# EAGLE board headstage-neuropix (EAGLE 8.3.2)
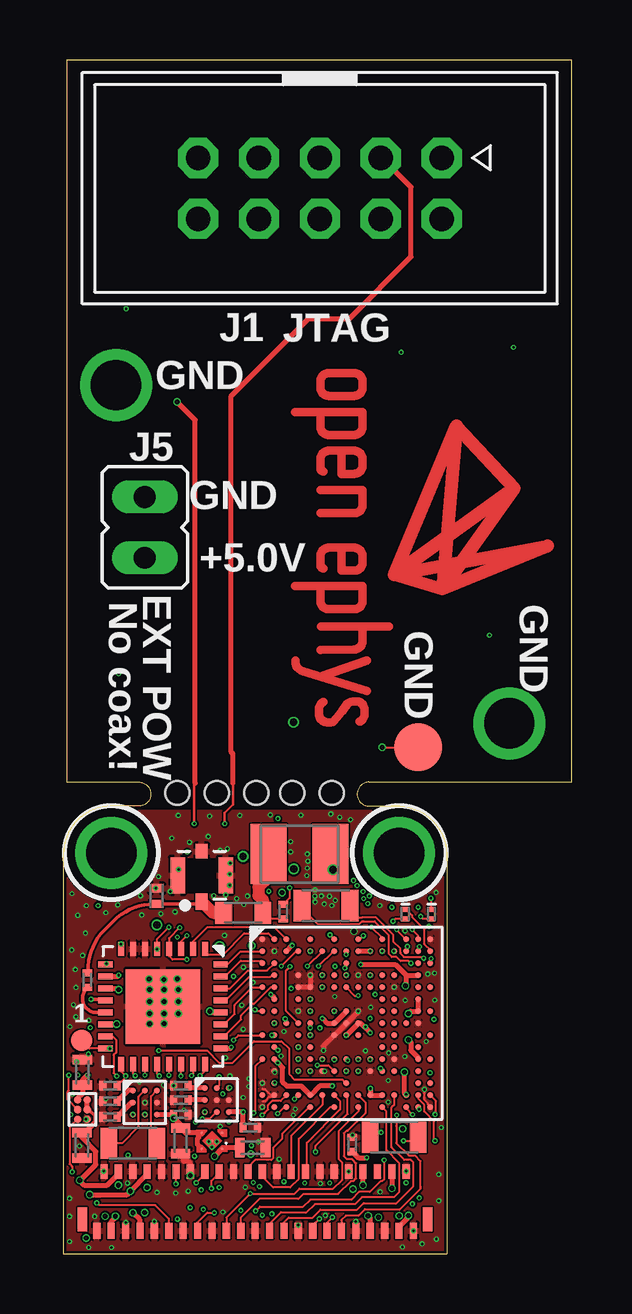
[diagram p5: board, top side]
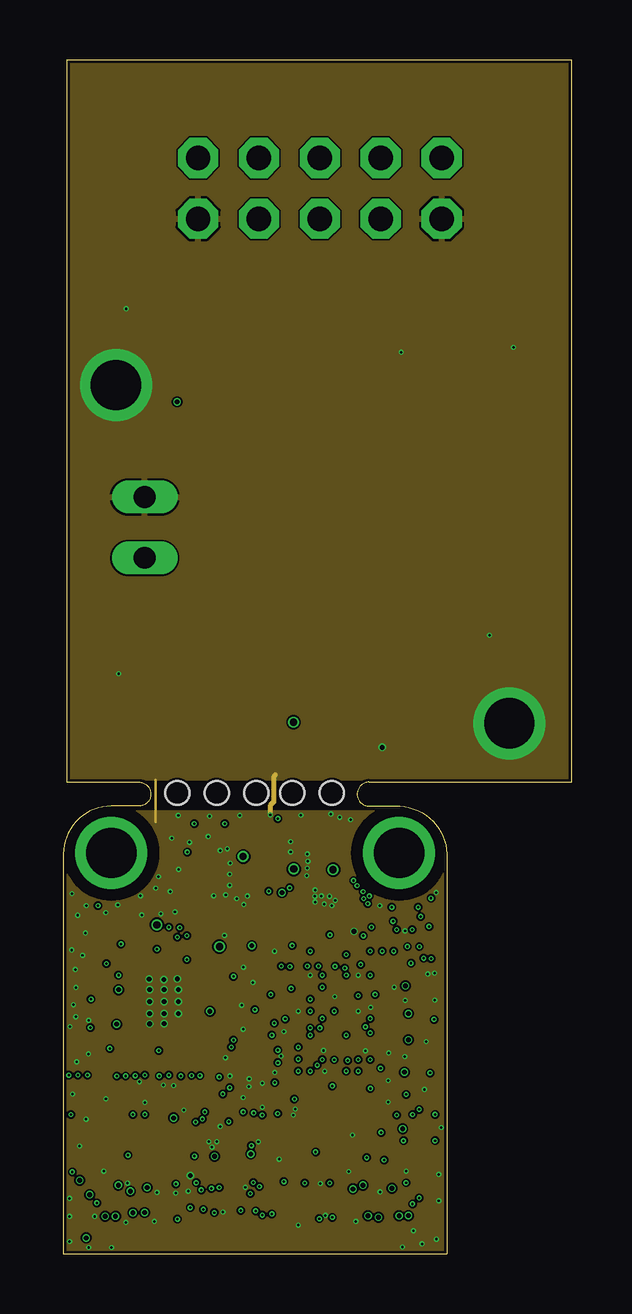
[diagram p6: board, inner layer GND1]
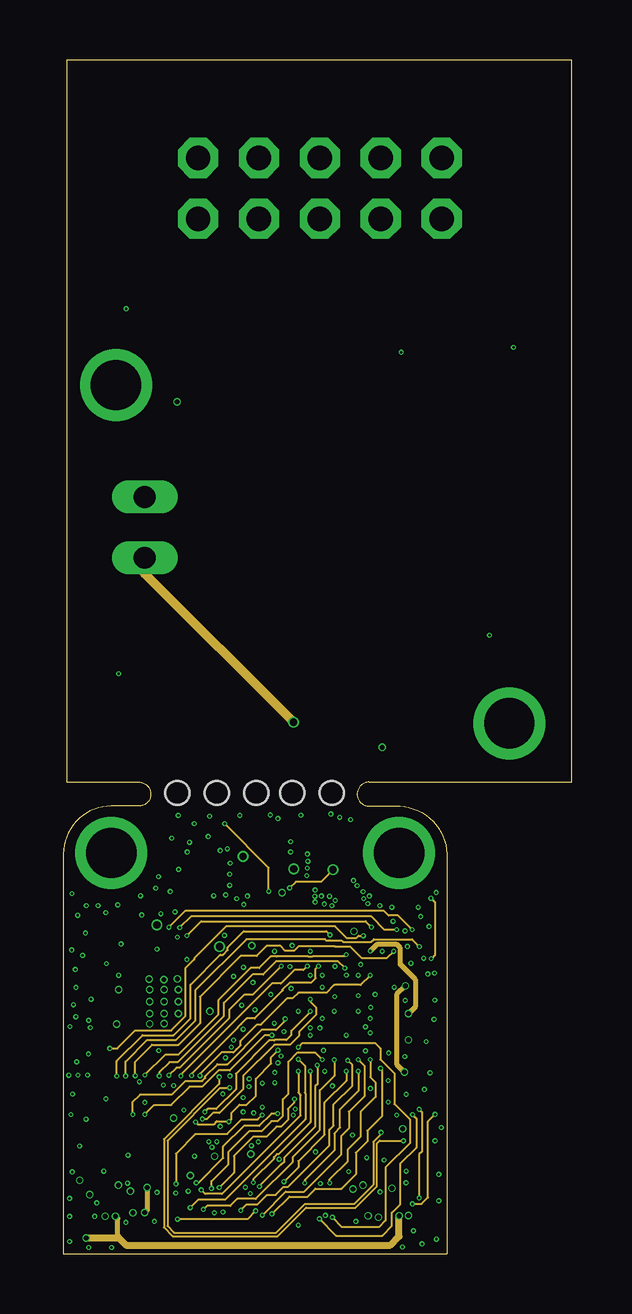
[diagram p7: board, inner layer Highspeed2]
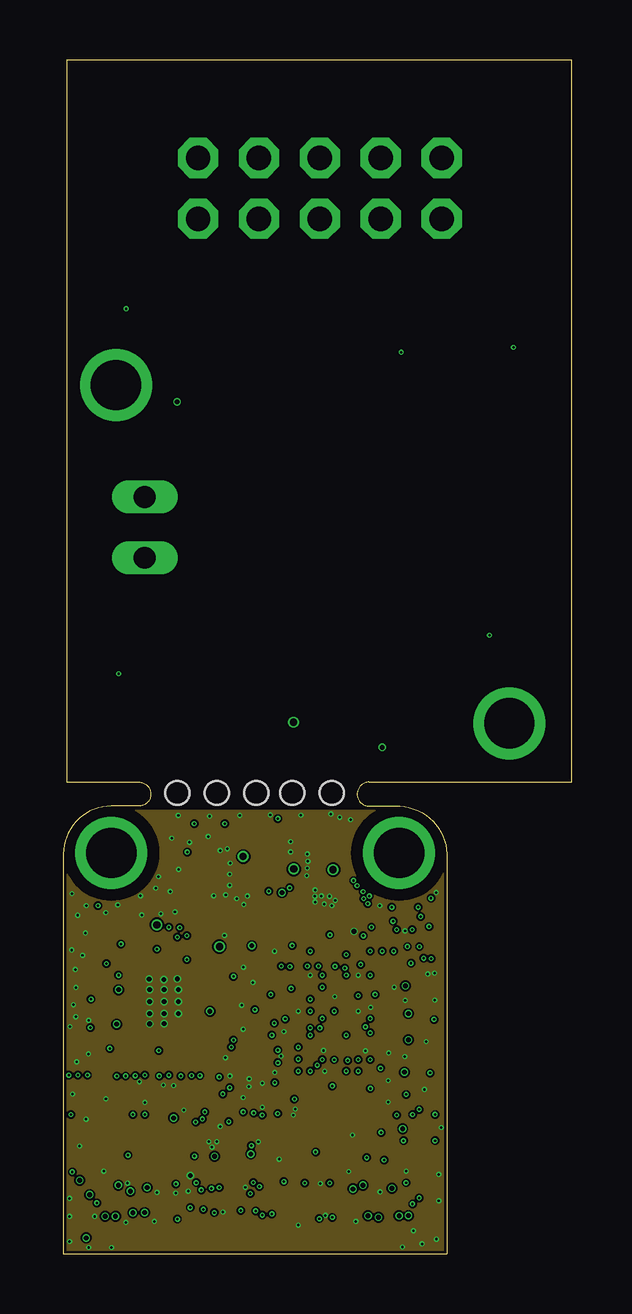
[diagram p8: board, inner layer GND2]
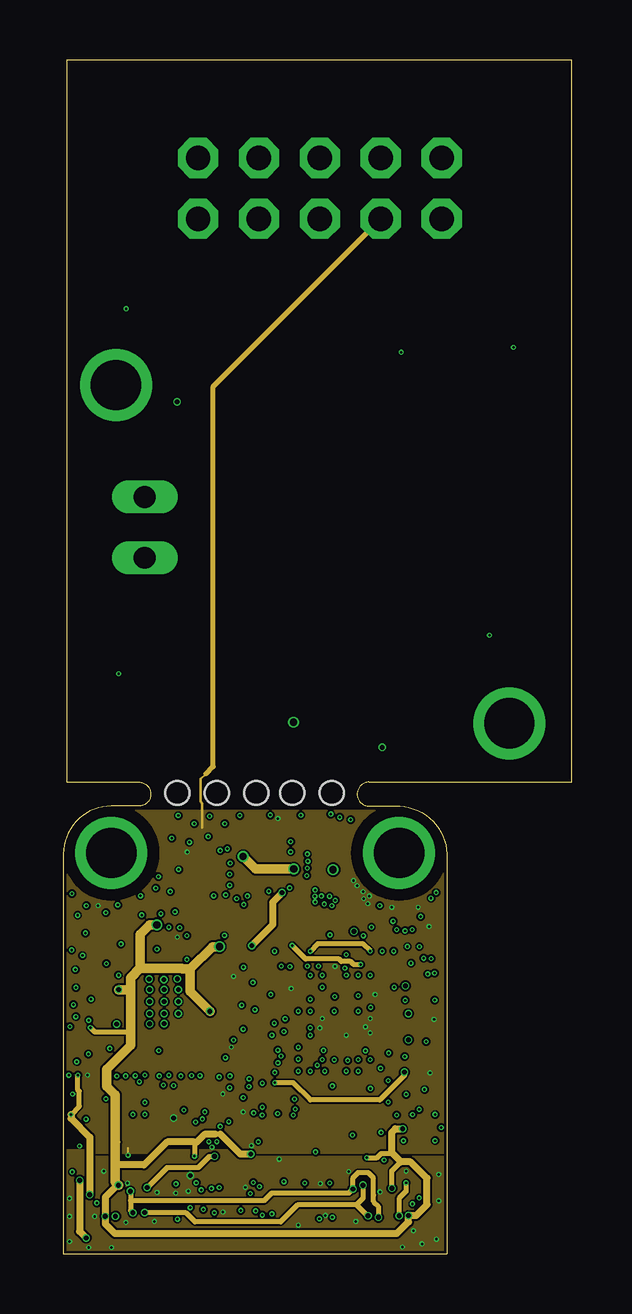
[diagram p9: board, inner layer VCC]
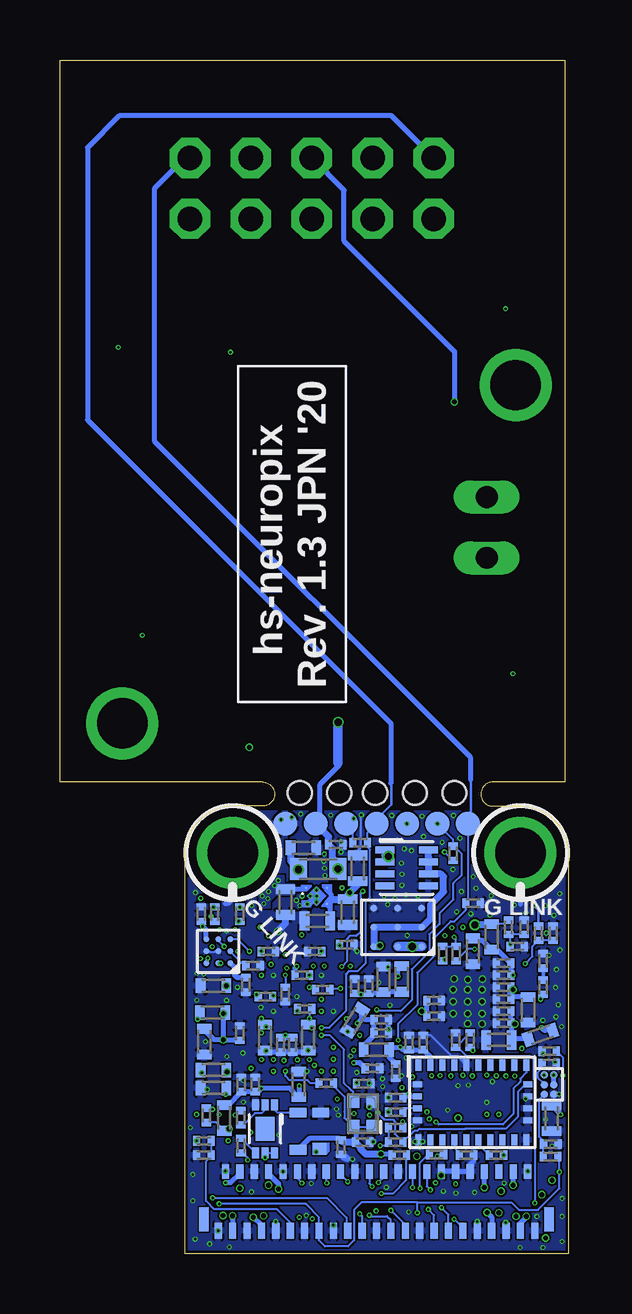
[diagram p10: board, bottom side, seen from below]

Size 21.2 x 49.75 mm. Coordinates in mm from the lower left corner, seen from the top.
Outline: 0.15,49.75 0.15,19.65 3.15,19.65 arc-90 3.65,19.15 arc-90 3.15,18.65 2,18.65 arc90 0,16.65 0,0 16,0 16,16.65 arc90 13.85,18.65 12.75,18.65 arc-90 12.25,19.15 arc-90 12.75,19.65 21.2,19.65 21.2,49.75 0.15,49.75
Copper layers (1*2*3+4*5*16): Highspeed1 0.036mm / dielectric 4mil / GND1 0.036mm / dielectric 5mil / Highspeed2 0.036mm / dielectric 0.10921875mm / GND2 0.036mm / dielectric 5mil / VCC 0.036mm / dielectric 4mil / LowSpeed 0.036mm
Design rules "speedy-6-layer-3mil-trace-space *": minimum track width 3mil, minimum drill 3mil, track to track 3mil, track to pad 3mil, pad to pad 3mil, via to via 3mil, smd to smd 2mil, copper to edge 5mil, drill to drill 5mil, minimum pad ring 2mil, minimum via ring 2mil, stop-mask expansion 1mil, vias tented up to drill 1mm, thermal gap 0.1mm
Net classes: 1 diff: width 0.09 mm, drill 0.2 mm, clearance 0.09 mm
Holes 1 mm at 8.05,19.2 4.75,19.2 6.4,19.2 9.55,19.2 11.2,19.2
tKeepout: area 12,14.7 to 16,18.7; area 0,14.7 to 4,18.7
bKeepout: area 11.9,14.6 to 16.1,18.8; area -0.1,14.6 to 4.1,18.8
tRestrict: area -0.1,14.6 to 4.1,18.8; area 11.9,14.6 to 16.1,18.8
bRestrict: area -0.1,14.6 to 4.1,18.8; area 11.9,14.6 to 16.1,18.8
vRestrict: area 11.9,14.6 to 16.1,18.8

## Footprints (pad centres in the part's own frame; a part is rotated, then mirrored left to right if it is on the bottom)
0201T = smd 0.3 x 0.4: 1 -0.3,0; 2 0.3,0
0402T = smd 0.4 x 0.6: 1 -0.533,0; 2 0.533,0
0402TW = smd 0.4 x 0.8: 1 -0.533,0; 2 0.533,0
LED-0201T = smd 0.2 x 0.35: 1 -0.2,0; 2 0.2,0
0402T-DFN = smd 0.35 x 0.6: A -0.325,0; C 0.325,0
0805PT-NOSILK = smd 0.7 x 1.3: A -1,0; C 1,0
2X05_IDC = drill 1.016 pad 1.676 octagon: 1 -5.08,-1.27; 2 -5.08,1.27; 3 -2.54,-1.27; 4 -2.54,1.27; 5 0,-1.27; 6 0,1.27; 7 2.54,-1.27; 8 2.54,1.27; 9 5.08,-1.27; 10 5.08,1.27
X_FL_R_SMT_1(02) = smd 0.5 x 0.7: P$1 0,-1.1 | smd 0.6 x 1.5: P$2 -1,0; P$4 1,0 | smd 0.5 x 0.6: P$3 0,1
1-2013496-8 = smd 0.3 x 0.65: 1 -6.6,0; 3 -6,0; 5 -5.4,0; 7 -4.8,0; 9 -4.2,0; 11 -3.6,0; 13 -3,0; 15 -2.4,0; 17 -1.8,0; 19 -1.2,0; 21 -0.6,0; 23 0,0; 25 0.6,0; 27 1.2,0; 29 1.8,0; 31 2.4,0; 33 3,0; 35 3.6,0; 37 4.2,0; 39 4.8,0; 41 5.4,0; 43 6,0; 45 6.6,0 | smd 0.3 x 0.6: 2 -6.3,2.475; 4 -5.7,2.475; 6 -5.1,2.475; 8 -4.5,2.475; 10 -3.9,2.475; 12 -3.3,2.475; 14 -2.7,2.475; 16 -2.1,2.475; 18 -1.5,2.475; 20 -0.9,2.475; 22 -0.3,2.475; 24 0.3,2.475; 26 0.9,2.475; 28 1.5,2.475; 30 2.1,2.475; 32 2.7,2.475; 34 3.3,2.475; 36 3.9,2.475; 38 4.5,2.475; 40 5.1,2.475; 42 5.7,2.475; 44 6.3,2.475 | smd 0.4 x 1: MECH1 -7.2,0.475; MECH2 7.2,0.475
JP2 = drill 0.914 long: 1 0,0; 2 2.54,0
0603T = smd 0.7 x 0.9: 1 -0.82,0; 2 0.82,0
1210T = smd 1.5 x 2.5: 1 -1.3,0; 2 1.3,0
TP10R = smd 1 x 1: TP 0,0
TP09R = smd 0.9 x 0.9: TP 0,0
TP20R = smd 2 x 2: TP 0,0
MBGA153-8X8 = smd 0.25 x 0.25: A1 -3.5,3.5; A2 -3,3.5; A3 -2.5,3.5; A5 -1.5,3.5; A7 -0.5,3.5; A9 0.5,3.5; A11 1.5,3.5; A13 2.5,3.5; A14 3,3.5; A15 3.5,3.5; B1 -3.5,3; B2 -3,3; B3 -2.5,3; B4 -2,3; B5 -1.5,3; B6 -1,3; B7 -0.5,3; B8 0,3; B9 0.5,3; B10 1,3; B11 1.5,3; B12 2,3; B13 2.5,3; B14 3,3; B15 3.5,3; C1 -3.5,2.5; C2 -3,2.5; C8 0,2.5; C14 3,2.5; C15 3.5,2.5; D2 -3,2; D4 -2,2; D5 -1.5,2; D6 -1,2; D7 -0.5,2; D8 0,2; D9 0.5,2; D10 1,2; D11 1.5,2; D12 2,2; D14 3,2; E1 -3.5,1.5; E2 -3,1.5; E4 -2,1.5; E5 -1.5,1.5; E6 -1,1.5; E7 -0.5,1.5; E8 0,1.5; E9 0.5,1.5; E10 1,1.5; E11 1.5,1.5; E12 2,1.5; E14 3,1.5; E15 3.5,1.5; F2 -3,1; F4 -2,1; F5 -1.5,1; F11 1.5,1; F12 2,1; F14 3,1; G1 -3.5,0.5; G2 -3,0.5; G4 -2,0.5; G5 -1.5,0.5; G7 -0.5,0.5; G8 0,0.5; G9 0.5,0.5; G11 1.5,0.5; G12 2,0.5; G14 3,0.5; G15 3.5,0.5; H2 -3,0; H3 -2.5,0; H4 -2,0; H5 -1.5,0; H7 -0.5,0; H8 0,0; H9 0.5,0; H11 1.5,0; H12 2,0; H13 2.5,0; H14 3,0; J1 -3.5,-0.5; J2 -3,-0.5; J4 -2,-0.5; J5 -1.5,-0.5; J7 -0.5,-0.5; J8 0,-0.5; J9 0.5,-0.5; J11 1.5,-0.5; J12 2,-0.5; J14 3,-0.5; J15 3.5,-0.5; K2 -3,-1; K4 -2,-1; K5 -1.5,-1; K11 1.5,-1; K12 2,-1; K14 3,-1; L1 -3.5,-1.5; L2 -3,-1.5; L4 -2,-1.5; L5 -1.5,-1.5; L6 -1,-1.5; L7 -0.5,-1.5; L8 0,-1.5; L9 0.5,-1.5; L10 1,-1.5; L11 1.5,-1.5; L12 2,-1.5; L14 3,-1.5; L15 3.5,-1.5; M2 -3,-2; M4 -2,-2; M5 -1.5,-2; M6 -1,-2; M7 -0.5,-2; M8 0,-2; M9 0.5,-2; M10 1,-2; M11 1.5,-2; M12 2,-2; M14 3,-2; N1 -3.5,-2.5; N2 -3,-2.5; N8 0,-2.5; N14 3,-2.5; N15 3.5,-2.5; P1 -3.5,-3; P2 -3,-3; P3 -2.5,-3; P4 -2,-3; P5 -1.5,-3; P6 -1,-3; P7 -0.5,-3; P8 0,-3; P9 0.5,-3; P10 1,-3; P11 1.5,-3; P12 2,-3; P13 2.5,-3; P14 3,-3; P15 3.5,-3; R1 -3.5,-3.5; R2 -3,-3.5; R3 -2.5,-3.5; R5 -1.5,-3.5; R7 -0.5,-3.5; R9 0.5,-3.5; R11 1.5,-3.5; R13 2.5,-3.5; R14 3,-3.5; R15 3.5,-3.5
ASCO = smd 0.6 x 0.5: 1 -0.55,-0.4; 2 0.55,-0.4; 3 0.55,0.4; 4 -0.55,0.4
UDFN8-2X2 = smd 0.8 x 0.3: 1 -0.91,0.75; 2 -0.91,0.25; 3 -0.91,-0.25; 4 -0.91,-0.75; 5 0.91,-0.75; 6 0.91,-0.25; 7 0.91,0.25; 8 0.91,0.75
WQFN32-5X5 = smd 0.25 x 0.6: 1 1.75,2.4; 2 1.25,2.4; 3 0.75,2.4; 4 0.25,2.4; 5 -0.25,2.4; 6 -0.75,2.4; 7 -1.25,2.4; 8 -1.75,2.4; 17 -1.75,-2.4; 18 -1.25,-2.4; 19 -0.75,-2.4; 20 -0.25,-2.4; 21 0.25,-2.4; 22 0.75,-2.4; 23 1.25,-2.4; 24 1.75,-2.4 | smd 0.6 x 0.25: 9 -2.4,1.75; 10 -2.4,1.25; 11 -2.4,0.75; 12 -2.4,0.25; 13 -2.4,-0.25; 14 -2.4,-0.75; 15 -2.4,-1.25; 16 -2.4,-1.75; 25 2.4,-1.75; 26 2.4,-1.25; 27 2.4,-0.75; 28 2.4,-0.25; 29 2.4,0.25; 30 2.4,0.75; 31 2.4,1.25; 32 2.4,1.75 | smd 3.1 x 3.1: PAD 0,0
X2SON = smd 0.1 x 0.1: 1 -0.43,0.33; 2 -0.43,-0.33; 3 0.43,-0.33; 4 0.43,0.33 | smd 0.1 x 0.1 rotated 45: PAD 0,0
MICROSIP9-3X2.3 = smd 0.3 x 0.3: A1 -1,0.8; A2 0,0.8; A3 1,0.8; B1 -1,0; B2 0,0; B3 1,0; C1 -1,-0.8; C2 0,-0.8; C3 1,-0.8
LGA-28-3.8X5.2 = smd 0.25 x 0.475: 1 -2.25,1.56; 6 -2.25,-1.56; 7 -1.75,-1.56; 8 -1.25,-1.56; 9 -0.75,-1.56; 10 -0.25,-1.56; 11 0.25,-1.56; 12 0.75,-1.56; 13 1.25,-1.56; 14 1.75,-1.56; 15 2.25,-1.56; 20 2.25,1.56; 21 1.75,1.56; 22 1.25,1.56; 23 0.75,1.56; 24 0.25,1.56; 25 -0.25,1.56; 26 -0.75,1.56; 27 -1.25,1.56; 28 -1.75,1.56 | smd 0.375 x 0.25: 2 -2.3,0.75; 3 -2.3,0.25; 4 -2.3,-0.25; 5 -2.3,-0.75; 16 2.3,-0.75; 17 2.3,-0.25; 18 2.3,0.25; 19 2.3,0.75
VFLGA4-2.0X1.6 = smd 0.5 x 0.57: 1 -0.725,-0.425 | smd 0.4 x 0.7: 2 0.775,-0.475; 3 0.775,0.475; 4 -0.775,0.475
DFN6_2X1.3_PAD = smd 0.45 x 0.3: 1 -1,0.4; 2 -1,0; 3 -1,-0.4; 4 1,-0.4; 5 1,0; 6 1,0.4 | smd 1 x 0.8: PAD 0,0
WLCSP3X3 = smd 0.25 x 0.25: A1 -0.5,0.5; A2 0,0.5; A3 0.5,0.5; B1 -0.5,0; B2 0,0; B3 0.5,0; C1 -0.5,-0.5; C2 0,-0.5; C3 0.5,-0.5
WLCSP6-1X1.2 = smd 0.305 x 0.305: A1 -0.2,0.4; A2 0.2,0.4; B1 -0.2,0; B2 0.2,0; C1 -0.2,-0.4; C2 0.2,-0.4

## Placement (x,y rotation side)
C1  22nF  [0201T]  9.24,12.88 0 bottom
C2  22nF  [0201T]  11.5,8.7 270 bottom
C3  0.1uF  [0201T]  8.53,7.08 0 bottom
C4  0.1uF  [0201T]  12,8.7 270 bottom
C5  4.7uF  [0402T]  14.8,11.16 180 bottom
C6  4.7uF  [0402T]  12.65,9 270 bottom
C7  10uF  [0402T]  14.8,6.9 180 bottom
C8  10uF  [0402T]  10.85,9 270 bottom
C9  22nF  [0201T]  8.17,7.72 0 bottom
C10  22nF  [0201T]  13.7,9.19 90 bottom
C11  10nF  [0201T]  8.58,4.64 180 bottom
C12  22nF  [0201T]  8.32,11.15 90 bottom
C13  22nF  [0201T]  7.8,9.75 0 bottom
C14  22nF  [0201T]  13.64,7.05 90 bottom
C15  22nF  [0201T]  12.51,12.59 0 bottom
C16  0.1uF  [0201T]  8.91,11.14 90 bottom
C17  0.1uF  [0201T]  7.8,9.2 0 bottom
C18  0.1uF  [0201T]  13.05,7.05 90 bottom
C19  0.1uF  [0201T]  10.58,12.59 180 bottom
C20  10uF  [0402T]  8.9,9.72 238.2 bottom
C21  10uF  [0402T]  11.25,7.05 90 bottom
C22  10uF  [0402T]  15.18,8.83 270 bottom
C23  10uF  [0402T]  7.71,11.43 90 bottom
C24  0.1uF  [0201T]  7.2,6.5 180 bottom
C25  10uF  [0402TW]  9.2,14.23 270 bottom
C26  0.1uF  [0201T]  6.05,8.8 90 bottom
C27  10uF  [0402TW]  8.78,16.06 90 bottom
C28  0.1uF  [0201T]  5.6,10.55 0 bottom
C29  0.1uF  [0201T]  7.2,7.6 270 bottom
C30  10nF  [0201T]  5.6,9.9 0 bottom
C31  10nF  [0201T]  6.65,8.8 90 bottom
C32  10uF  [0402TW]  10.47,13.86 180 bottom
C33  10uF  [0402TW]  4.89,4.7 270 top
C34  0.1uF  [0201T]  4.25,4.1 180 bottom
C35  10nF  [0201T]  2.7,12.1 180 bottom
C36  10nF  [0201T]  2.7,11.1 180 bottom
C37  10nF  [0201T]  2.7,10.1 180 bottom
C38  0.1uF  [0201T]  2.7,11.6 180 bottom
C39  0.1uF  [0201T]  2.7,10.6 180 bottom
C40  0.1uF  [0201T]  2.7,9.6 180 bottom
C41  10uF  [0402TW]  11.8,14.65 270 bottom
C42  10uF  [0402TW]  7.9,4.42 0 top
C43  0.1uF  [0201T]  1,11.4 270 top
C44  47nF  [0201T]  1.05,11.1 270 bottom
C45  4.7uF  [0402T]  3.98,12.6 270 bottom
C46  10uF  [0402T]  1.68,10.16 270 bottom
C47  10uF  [0402TW]  2.9,8.9 180 bottom
C48  1uF  [0201T]  0.63,13.35 90 bottom
C49  10nF  [0201T]  9.48,4.43 90 bottom
C50  0.1uF  [0201T]  2.13,12.8 0 bottom
C51  10uF  [0402T]  11.05,16.91 0 bottom
C52  10nF  [0201T]  12.05,4.55 270 top
C53  1uF  [0201T]  1.95,6.35 180 top
C54  1uF  [0201T]  4.9,7 180 top
C55  1uF  [0201T]  13.45,11.2 270 bottom
C57  0.1uF  [0201T]  4.9,5.8 0 top
C58  0.1uF  [0201T]  7.8,5.25 0 top
C59  0.1uF  [0201T]  15.3,14.15 90 bottom
C61  1uF  [0201T]  9.7,17.05 0 bottom
C62  1nF  [0201T]  0.8,8.44 180 bottom
C63  1nF  [0201T]  0.8,7.92 0 bottom
C64  10uF  [0402TW]  0.78,4.51 270 top
C65  10uF  [0402TW]  0.8,7.55 90 top
C66  10uF  [0402TW]  0.7,5.64 270 bottom
C67  1uF  [0201T]  0.73,4.56 0 bottom
D1  XZVGR155W  [LED-0201T]  15.35,14.15 270 top
D2  XZVGR155W  [LED-0201T]  14.25,14.15 270 top
D3  SESD0402X1UN-0020-090  [0402T-DFN]  3.89,14.9 270 top
D4  VEMD1160X01  [0805PT-NOSILK]  2.9,4.6 0 top
D5  VEMD1160X01  [0805PT-NOSILK]  13.8,4.85 180 top
D6  VEMD1160X01  [0805PT-NOSILK]  10.95,14.5 0 top
J1  302-S101  [2X05_IDC]  10.7,44.4 180 top
J2  X.FL-R-SMT-1(02)  [X_FL_R_SMT_1(02)]  5.77,15.77 0 top
J3  FH23-45S-0.3SHW(05)  [1-2013496-8]  8,0.95 0 top
J5  77311-118-02LF  [JP2]  3.4,29 90 top
J6  FH23-45S-0.3SHW(05)  [1-2013496-8]  8,0.95 0 bottom
L1  BLM15PX601SN1D  [0402T]  14.8,7.65 0 bottom
L2  BLM15PX601SN1D  [0402T]  6.95,11.44 270 bottom
L3  BLM15PX601SN1D  [0402T]  8,8.5 180 bottom
L4  BLM15PX601SN1D  [0402T]  14.35,5.65 90 bottom
L5  BLM15PX601SN1D  [0402T]  14.84,10.05 0 bottom
L6  BLM15PX601SN1D  [0402T]  3.2,13.2 270 bottom
L7  BLM15PX601SN1D  [0402T]  1.16,9.12 198.9 bottom
L8  BLM18KG601SN1D  [0603T]  10.43,16.03 0 bottom
L9  ADL3225V-470MT-TL000  [1210T]  9.85,16.65 0 top
L10  MPZ1608S102ATA00  [0603T]  7.5,14.2 0 top
R1  4.7k  [0201T]  7.2,4.65 180 bottom
R2  4.7k  [0201T]  7.2,5.25 180 bottom
R3  2k  [0201T]  14.75,14.15 270 bottom
R4  4.7k  [0201T]  10.1,7.1 0 bottom
R5  10k  [0201T]  11,10.2 180 bottom
R6  2k  [0201T]  13.7,14.15 270 bottom
R7  4.7k  [0201T]  15.1,5.76 270 bottom
R8  10k  [0201T]  4.81,16.68 90 bottom
R9  1k  [0201T]  3.97,14.6 0 bottom
R10  4.7k  [0201T]  5.5,4.12 0 bottom
R11  4.7k  [0201T]  5.24,12.5 90 bottom
R12  10k  [0201T]  11.8,10.8 270 bottom
R13  10k  [0201T]  8.68,17.13 0 bottom
R14  4.7k  [0201T]  7.05,4.1 180 bottom
R15  4.7k  [0201T]  4.68,12.5 90 bottom
R16  10k  [0201T]  12.63,10.71 0 bottom
R17  10k  [0201T]  11.1,11.6 0 bottom
R18  10k  [0201T]  10.25,11 180 bottom
R19  10k  [0201T]  3,4.1 0 bottom
R20  10k  [0201T]  1.25,13.35 270 bottom
R21  49.9  [0201T]  1.05,12.2 270 bottom
R22  10k  [0201T]  7.2,5.9 0 bottom
R23  10k  [0201T]  2.5,13.6 270 bottom
R24  100k  [0201T]  1.85,13.6 90 bottom
R25  2k  [0201T]  9.17,14.25 90 top
R26  22  [0201T]  13.65,4.5 270 bottom
R27  22  [0201T]  13.66,5.66 90 bottom
R28  20k  [0201T]  4.1,8.9 90 bottom
R29  100  [0201T]  4.7,8.9 90 bottom
R30  15k  [0201T]  1.95,5.7 0 top
R31  15k  [0201T]  4.9,6.4 0 top
R32  15k  [0201T]  13.15,12 180 bottom
R33  20k  [0201T]  15.2,4.7 0 bottom
R34  100  [0201T]  15.2,4.1 180 bottom
R35  6.6k  [0201T]  0.74,4.04 0 bottom
R36  10k  [0201T]  1.95,7 180 top
TP1  [TP10R]  10.54,17.92 180 bottom
TP2  [TP10R]  5.46,17.92 180 bottom
TP3  [TP10R]  4.19,17.92 180 bottom
TP4  [TP10R]  8,17.92 180 bottom
TP5  [TP10R]  6.73,17.92 180 bottom
TP6  [TP10R]  9.27,17.92 180 bottom
TP7  [TP10R]  11.81,17.92 180 bottom
TP10  [TP09R]  0.76,8.88 0 top
TP13  [TP20R]  14.8,21.1 270 top
U1  10M08SAM15317G  [MBGA153-8X8]  11.8,9.6 0 top
U2  ASCO2-24.000MHZ-EK-T3  [ASCO]  8.57,5.83 90 bottom
U3  MAX4945AELA+T  [UDFN8-2X2]  6.74,16.07 0 bottom
U4  DS90UB933_WQFN  [WQFN32-5X5]  4.16,10.3 0 top
U5  NCP161BMX330  [X2SON]  10.5,14.9 0 bottom
U6  TPS8268180  [MICROSIP9-3X2.3]  7.11,13.6 180 bottom
U7  TLV70712  [X2SON]  6.2,4.7 180 top
U8  BNO055  [LGA-28-3.8X5.2]  4,6.3 0 bottom
U9  DSC6102MI2A-093.6000  [VFLGA4-2.0X1.6]  10.8,5.1 90 bottom
U10  PL133-27GC-R  [DFN6_2X1.3_PAD]  12.65,5.2 270 bottom
U11  TS4231  [WLCSP3X3]  3.4,6.3 0 top
U12  TS4231  [WLCSP3X3]  6.4,6.4 0 top
U13  TS4231  [WLCSP3X3]  14.6,12.6 180 bottom
U14  [WLCSP6-1X1.2]  0.8,6 0 top
U15  [WLCSP6-1X1.2]  0.81,7.04 0 bottom
X2  OE-LOGO_14X10  [OE-LOGO-14X10]  13.4,30.1 270 top

## Tracks (layer width: path | path; a pad name or v marks a point on that pad's centre or on a via)
1V2A  (via drill 0.1, 0.2)
  Highspeed1 0.2: J3.8 3.5,3.3 v2.8,2.6 2.65,2.45 v1.1,2.45 | J3.7 3.2,1.4 v2.9,1.7
  VCC 0.2: v2.8,2.6 2.8,2.2 | U15.A2 0.61,6.82 0.67,6.76 0.67,6.14 v0.32,5.79 | 2.8,2.2 8.37,2.2 8.7,2.53 11.91,2.53 v12.08,2.69 12.08,3.16 12.29,3.37 12.71,3.37 12.93,3.15 12.93,2.46 12.94,2.45 12.94,2.16 13.14,1.96 v13.14,1.51 | 2.8,2.2 2.8,1.8 v2.9,1.7
  VCC 0.3: v1.1,2.45 1.1,4.85 0.32,5.63 v0.32,5.79
  LowSpeed 0.2: U15.B2 U15.A2 | v0.32,5.79 C66.1 | J6.7 12.8,1.17 v13.14,1.51 | J6.8 12.5,3.33 12.08,2.91 v12.08,2.69
  other vias: 0.61,7.44
1V8A  (via drill 0.1, 0.2)
  Highspeed1 0.15: 1.33,5.46 1.33,5.74 1.07,6
  Highspeed1 0.2: 1.33,5.46 0.91,5.04 C64.1 0.78,4.83 1.36,4.25 1.36,3.7 0.7,3.05 v0.68,3.05 0.9,2.83 1.24,2.83 1.8,2.83 2.3,3.33 J3.4 | U14.A2 U14.B2 1.07,6 | J3.3 2,1.34 2.18,1.51 v2.18,1.56
  Highspeed2 0.2: 2.27,0.7 2.27,1.47 v2.18,1.56
  Highspeed2 0.3: v14,1.57 14,0.71 13.64,0.35 2.62,0.35 2.27,0.7 2.22,0.65 v0.95,0.65
  VCC 0.2: v14,1.57 14,2.3 14.29,2.59 v14.29,2.95
  VCC 0.3: v0.95,0.65 0.68,0.92 v0.68,3.05
  LowSpeed 0.2: 14,1.43 J6.3 | 14,1.43 14,1.52 | v14.29,2.95 14.08,2.95 13.7,3.33 J6.4 | v14,1.57 14,1.43
24MHZ_P  (via drill 0.1)
  LowSpeed 0.076: U1.J5 9.95,9.1 9.36,8.51 9.36,7.1 9.09,6.84 9.09,6.83 8.97,6.71 U2.3
  other vias: 10.3,9.1
!IMU_BL
  LowSpeed 0.076: U8.4 6.75,6.05 R22.2
!IMU_RESET
  LowSpeed 0.076: U8.11 3.75,4.55 R19.1
+1V2  (via drill 0.2)
  Highspeed1 0.076: 6.86,4.42 6.81,4.37 U7.1
  Highspeed1 0.2: v12.5,2.85 J3.38 | 6.86,4.42 C42.1 | U7.1 v6.31,4.05 | J3.39 12.8,1.48 v12.71,1.57
  Highspeed2 0.2: v3.39,1.71 3.5,1.82 v3.5,2.75
  VCC 0.2: v6.31,4.05 6.1,4.05 5.62,3.58 4.33,3.58 v3.5,2.75 | v3.39,1.71 5.1,1.71 5.5,1.31 9.06,1.31 9.78,2.03 12.22,2.03 | v12.71,1.57 12.68,1.57 12.22,2.03 | v12.5,2.85 12.5,2.31 12.22,2.03
  LowSpeed 0.2: v3.5,2.75 J6.38 | J6.39 3.2,1.52 v3.39,1.71
+1V8  (via drill 0.1, 0.2, 0.3)
  Highspeed1 0.2: U4.28 6.16,10.05 v6.11,10.1 | U4.11 2.31,11.05 v2.31,11 | J3.42 v13.7,2.72 | C52.2 12.3,4 v12.65,4 | v14.4,1.58 14.33,1.51 14.33,1.44 14,1.11 J3.43
  VCC 0.2: 5.45,4.65 5.47,4.63 v5.47,4.06 | 6.35,4.99 6.54,4.99 6.55,4.97 | 2.78,8.9 2.81,8.87 | v1.13,9.42 1.31,9.23 2.73,9.23 2.81,9.31 | v12.65,4 13.08,4 13.26,4.17 13.68,4.17 13.7,4.19 | v13.7,2.72 13.7,3.45 14.07,3.82
  VCC 0.3: v14.15,5.2 13.85,5.2 13.7,5.05 13.7,4.19 14.07,3.82 14.48,3.82 15.16,3.14 15.16,2.03 14.71,1.58 v14.4,1.58 14.4,1.32 13.91,0.83 2.15,0.83 1.75,1.23 v1.75,1.55 1.75,2.35 2.25,2.85 v2.3,2.85 | v7.82,4.15 7.37,4.15 6.55,4.97 | 6.35,4.99 5.92,4.99 5.58,4.65 5.45,4.65 4.33,4.65 3.37,3.69 2.16,3.69 | 2.23,4.65 2.16,4.72
  VCC 0.4: 2.81,11 2.81,11.5 3.21,11.9 | 2.81,11 2.81,9.31 2.81,8.87 2.81,8.68 1.8,7.67 1.8,6.96 2.16,6.61 2.16,4.72 2.16,3.69 2.16,2.99 v2.3,2.85 | v2.31,11 2.81,11 | 3.21,11.9 3.21,13.31 3.6,13.7 v3.9,13.7 | 5.29,11.87 5.29,10.92 v6.11,10.1 | 5.29,11.87 5.3,11.88 5.31,11.88 6.22,12.79 v6.51,12.79 | 5.29,11.87 4.96,11.87 4.96,11.88 3.23,11.88 3.21,11.9
  LowSpeed 0.076: L4.1 14.69,5.46 R7.2 | R23.1 2.67,13.73 L6.1 | U2.1 8.84,5.28 U2.4 9.35,5.66 9.35,5.92 9.33,5.93 9.33,6.53 9.8,7 R4.2 | 8.85,4.67 C11.2 | U10.5 U10.6
  LowSpeed 0.15: 12.65,4.35 U10.5 | L4.1 14.17,5.12 14.15,5.1
  LowSpeed 0.2: 5.9,10.1 C28.1 | 5.9,10.1 C30.1 | v6.11,10.1 5.9,10.1 | v2.3,2.85 J6.42 | v7.82,4.15 7.4,4.15 R14.2 | R10.2 5.26,4.06 v5.47,4.06 | U10.5 v12.65,4 | 2,0.85 J6.43 2,1.27 1.75,1.52 v1.75,1.55 | 8.85,5.16 U2.4 8.81,5.28 | C11.2 8.84,4.68 8.84,5.28 | C46.1 2.31,10.69 C39.1 | U9.4 10.8,4.8 9.55,4.8 C49.2 | L7.1 1,9.29 v1.13,9.42
  LowSpeed 0.203: C36.1 v2.31,11
  LowSpeed 0.3: L6.1 3.23,13.7 v3.9,13.7 | C39.1 C36.1 | L4.1 14.23,5.12 v14.15,5.2 | C49.2 9.39,4.64 C11.2 8.66,4.42 8.66,4.35 8.46,4.15 v7.82,4.15
  LowSpeed 0.4: 6.52,12.8 U6.A2 | 6.52,12.8 v6.51,12.79 | U6.A1 6.52,12.8
+3V3  (via drill 0.1, 0.2)
  Highspeed1 0.2: U1.J8 U1.H9 12.4,9.6 v12.8,9.2 | U1.G8 U1.H7 11,9.6 v10.8,9.8 | U7.3 5.65,5.03 | U11.C3 C57.1 v4.6,5.65 4.89,5.36 C33.1 5.09,5.03 5.65,5.03 | U12.C3 R22.1 C58.1 | U4.25 6.96,8.55 v7.01,8.6 | 5.65,5.03 5.65,4.83 5.6,4.78 5.6,4.54 U7.4 | C65.1 | C65.1 0.8,7.23 U15.A1 | C65.1 0.8,6.67 0.6,6.46 U14.A1
  VCC 0.076: R19.2 2.7,4.39
  VCC 0.1: 5.95,20 5.72,19.77 5.72,18.84 5.79,18.77 5.79,17.75
  VCC 0.2: J1.4 6.25,36.14 6.25,20.3 5.95,20
  LowSpeed 0.076: C58.1 R1.2 7.66,4.49 v7.84,4.49 | R11.2 R15.2 4.68,13.11 v4.76,13.19 | R6.1 v13.7,14.43 | R5.1 10.8,10.1 v10.8,9.8 | R18.1 9.9,11.05 v9.5,11.05 | R8.1 | R8.1 v5.17,16.73 | TP6.TP 9.27,17.86 8.98,17.57 R13.1
  LowSpeed 0.1: v1.45,14.5 1.25,14.3 R20.1
  LowSpeed 0.15: 6.6,6.55 6.66,6.56
  LowSpeed 0.2: C2.1 11.75,9 | 11.75,9 C4.1 | 11.75,9 11.75,9.05 arc-90 U1.J8 | 6.6,6.55 U8.3 | 6.6,6.55 6.85,6.55 C24.1 | v11.33,11.97 11.4,11.9 R17.1 | TP6.TP 9.16,17.92 v8.95,18.13 | U5.1 10.98,15.18 C41.1 | U13.C3 15.1,13.48 v15.25,13.63 15.25,13.8 C59.1 | C29.1 7.47,8.17 L3.1 7.37,8.6 v7.01,8.6 6.91,8.5 C31.1 C26.1 5.75,8.2 U8.28 | v10.8,9.8 10.8,9.58 C8.1 | v12.8,9.8 12.8,9.68 C6.1 | L5.1 15.37,9.85 v15.46,9.76 | R3.1 14.78,14.45 v14.8,14.43 | v6.65,6.65 6.65,6.6 6.6,6.55 | v7.1,11.55 7.1,11.82 L2.1
  LowSpeed 0.203: R16.1 v12.99,10.81 v13,10.8 | L1.1 15.33,7.57 v15.29,7.53
  LowSpeed 0.3: C41.1 11.75,15.23
  other vias: 11.8,9.1 7.5,5.9 10.7,9.4 12.6,9.45 2.7,4.1 12.25,15.33 12.5,15.08 12.76,14.9 12.7,14.58 12.1,15.55 12.53,14.79 1.01,7.44
  pour VCC (rank 3, no thermals): 0,18.45 0,4.2 16,4.2 16.05,14.05 16,18.45
  pour LowSpeed (rank 2, no thermals): 11.45,15.4 11.45,14.95 12.2,14.95 12.45,14.7 12.45,14.4 12.9,14.4 12.9,14.95 12.08,15.77 11.85,15.77 11.85,15.4
BNO_SCL  (via drill 0.1)
  Highspeed1 0.076: U1.L1 8,7.8 8,5.92 v7.94,5.86
  LowSpeed 0.076: U8.19 1.8,7.05 2.1,6.75 2.1,5.7 2.6,5.2 4.3,5.2 6.21,5.2 6.3,5.11 6.42,5.11 6.45,5.08 6.47,5.08 R1.1 | v7.94,5.86 7.76,5.68 7.76,5.65 7.7,5.59 7.32,5.59 7.24,5.5 7.24,4.99 R1.1 | R1.1 6.86,4.65
BNO_SDA  (via drill 0.1)
  Highspeed1 0.076: v8.95,8.47 8.82,8.6 U1.K2
  Highspeed2 0.076: v8.95,8.47 8.66,8.19 8.66,7.92 8.03,7.29 8.03,6.58 7.65,6.2 7.35,6.2 7,5.85 7,5.59 v6.91,5.5 6.89,5.51 6.41,5.51 | v5.52,5.48 5.6,5.39 6.29,5.39 6.36,5.46 | 6.36,5.46 6.41,5.51 | 6.41,5.51 6.36,5.46
  LowSpeed 0.076: U8.20 1.75,7.55 2.01,7.29 2.01,7.16 2.29,6.88 2.29,5.82 2.73,5.38 5.42,5.38 v5.52,5.48 | R2.1 v6.9,5.49 v6.91,5.5
CAL_A_1KHZ  (via drill 0.1)
  Highspeed1 0.076: U1.N8 11.65,7.25 9.65,7.25 9.43,7.48 9.43,8.53 9.1,8.85 7.95,8.85 7.05,7.94 6.5,7.94 5.99,8.46 v3.98,8.46
  LowSpeed 0.076: R28.1 4.1,8.58 v3.98,8.46
CAL_B_1KHZ  (via drill 0.1)
  Highspeed1 0.076: U1.P14 14.8,6.45 15.05,6.19 15.05,5.92 15.46,5.51 15.46,4.74 R33.1
  other vias: 15.5,4.7
CAL_SIGNAL_A  (via drill 0.1)
  Highspeed1 0.076: J3.11 4.4,1.45 3.84,2.01 1.5,2.01 v1.4,2.11
  LowSpeed 0.076: R28.2 R29.1 4.61,8.6 4.26,8.25 1.61,8.25 1.46,8.09 1.46,7.28 1.4,7.22 v1.4,2.11
CAL_SIGNAL_A1
  LowSpeed 0.076: R33.2 R34.1 14.9,4.05 15.11,3.84 15.11,2.2 14.77,1.85 12.15,1.85 11.6,1.3 J6.11
CONF_DONE  (via drill 0.1)
  LowSpeed 0.076: R18.2 10.65,11.1 U1.E6
  other vias: 10.8,11.1
CONFIG_SEL  (via drill 0.1)
  Highspeed1 0.09: U1.D8
  LowSpeed 0.076: U1.D8 R12.1
  other vias: 11.8,11.6
GND  (via drill 0.1, 0.2, 2.1 pad 3)
  Highspeed1 0.076: U1.R15 15.21,6.19 15.21,6.26 15.06,6.41 v15.06,6.84
  Highspeed1 0.09: v13.3,21.1 TP13.TP
  Highspeed1 0.1: U1.M6 v10.9,7.6 | 8.33,6.35 8.4,6.35 8.58,6.52 8.72,6.52 U1.P2 8.65,6.6 8.4,6.85 8.32,6.85 8.3,6.87
  Highspeed1 0.2: U1.G9 U1.H8 U1.J7 10.85,8.65 C8.2 | U1.D5 U1.E5 U1.E4 | C52.1 v12.06,4.94 | v5.3,3.25 5.3,3.76 5.22,3.84 5.03,3.84 5.03,4.07 4.99,4.07 C33.2
  GND1 0.1: 3.85,19.75 3.85,18
  GND1 0.2: 8.85,19.95 8.78,19.88 8.78,18.82 8.63,18.67 v8.63,18.28
  LowSpeed 0.076: U13.B3 14.96,12.6 14.94,12.58 14.76,12.58 14.74,12.6 U13.B2 | v8.63,18.28 8.66,18.25 8.66,16.94 8.67,16.93 | 8.9,3.91 8.91,3.91 | U8.25 4.51,8.12 4.51,8.15 4.58,8.21 4.85,8.21 5.74,9.1 C26.2
  LowSpeed 0.1: v10.9,7.6 11.23,7.6 C21.2
  LowSpeed 0.127: 8.67,16.93 8.69,16.91 8.69,16.87 8.78,16.78 C27.2
  LowSpeed 0.15: v0.8,12.43 0.98,12.43 R21.1
  LowSpeed 0.2: C6.2 arc-90 12.53,8.4 C4.2 C2.2 10.97,8.4 arc-90 C8.2 | C13.2 v7.5,9.35 C17.2 | 8.14,4.66 v8.13,4.66 | v2,16.7 2,14.56 | v14,16.7 14,14.8 14.22,14.58 14.3,14.58 | C1.2 8.94,12.73 v8.81,12.6 | v5.3,3.25 J6.32 J6.34 J6.36 4.1,3.71 3.95,3.86 C34.1 | U8.25 4.25,7.93 4.45,8.13 | U15.C2 v0.39,6.64 v0.39,6.65
  LowSpeed 0.3: v12.12,13.43 11.8,13.75 C41.2 | U5.PAD 10.83,14.57 U5.2 | C11.1 8.26,4.66 8.14,4.66 | 9.22,3.96 9.26,3.99 9.34,3.99 C49.1
  other vias: 3.58,11.44 4.19,11.42 4.76,11.45 4.8,11 4.2,11 3.6,11 3.6,10.5 3.6,10 4.2,10.5 4.2,10 3.6,9.57 4.2,9.58 12.3,10.1 4.8,10.5 4.8,10 12.6,8.45 13.55,7.21 12.3,11.6 14.25,10.55 14.24,8.21 7.51,11.93 8.3,7.1 8.3,6.1 7.5,6.5 10.85,8.47 9.8,10.1 9.2,9.25 6.54,5.3 6.95,7.4 7.75,7.28 10.3,11.6 13.8,11.1 4.6,7 5.03,5.98 1.78,6.45 9.8,1.18 7.59,2.76 6.66,1.73 2.61,1.3 3.85,15.23 10.5,15.15 0.36,15 6.94,15.81 7.53,14.55 4.52,17.31 10.17,16.06 3.97,15.71 3.22,14.91 2.27,14.53 1.77,14.21 0.92,13.36 3.27,14.11 4.07,14.16 12.82,10.26 11.32,10.71 13.57,8.36 3.17,7.16 11.98,18.08 11.53,18.18 0.68,4.48 3.8,1.34 4.17,7.02 1.06,9.72 0.52,9.87 0.53,11.09 0.5,11.84 0.35,12.65 0.6,14.1 15.48,11.69 15.49,10.56 15.13,8.83 17.77,25.77 14.09,37.57 2.62,39.38 2.31,24.17 9.08,8.23 4.66,14.24 0.56,7.99 7.44,10.35 6.76,8.16 13.55,6.31 18.77,37.77 6.94,15.35 4.46,15.09 6.96,16.27 10.2,16.35 10.15,15.75 0.96,14.5 7.68,14.9 11.2,14.5 10.5,14.65 10.76,14.9 13.2,14.5 14.25,13.45 15.55,15.05 15.2,11.65 5.26,17.14 6.72,13.26 7.74,6.96 6.54,16.8 7.23,14.79 6.84,16.87 4.81,16.01 6.77,14.95 6.27,14.91 7.91,11.3 7.36,18.26 6.1,18.23 6.04,17.38 4.79,18.26 0.28,9.46 3.4,6.3 6.4,4.66 6.07,4.66 6.2,4.43 11.1,14.89 10.88,14.57 10.93,1.59 14.96,0.4 10.72,2.92 9.48,17.17 9.48,16.74 10.18,16.65 11.16,18.32 0.42,10.37 9.67,6.02 9.59,5.77 8.82,7.55 9.91,18.27 1.05,8.32 0.95,5.6 11.34,14.72 10.49,14.89 18.6,22.1 2.2,36.2 4.69,2.52 15.56,0.6 15.66,2.2 15.66,3.3 15.76,5.25 5.21,2.6 3.91,2.55 1.31,1.55 2.01,0.25 1.06,0.25 0.26,0.5 0.26,1.55 0.26,2.3 13.21,2.57 14.3,3.43 14.6,0.95 12.2,1.34 1.69,3.43 2.68,2.93 9,3.93 11.9,3.42 14.14,0.27
  pour LowSpeed (rank 2): 2.6,12.4 2.6,8.6 5.7,8.6 5.7,11.9 4.1,11.9 4.1,12.4
  pour GND2 (rank 3, no thermals): 0,18.45 0,-11.3 16,-11.3 16.05,14.05 16,18.45
  pour GND1 (rank 3): -42,56.8 -42,-9.7 58,-9.7 58,56.8
  pour LowSpeed (rank 3): 0,18.45 0,-13.35 16,-13.35 16.05,14.05 16,18.45
  pour Highspeed1 (rank 3): 0,18.45 0,-9 16,-9 16.05,14.05 16,18.45
  pour VCC (rank 4): 0,-10.7 16,-10.7 16,4.3 0,4.3
I2C_SCL_A  (via drill 0.1)
  Highspeed1 0.076: U1.R9 12.3,5.92 11.48,5.1 11.48,3.94 11.61,3.81 11.61,3.06 11.25,2.7 9.85,2.7 9.65,2.5 v7.8,2.5 6.8,1.5 J3.19
  LowSpeed 0.076: R14.1 6.78,4.08 6.78,3.05 7.33,2.5 v7.8,2.5
I2C_SCL_B  (via drill 0.1)
  Highspeed1 0.076: U1.R14 14.84,6.06 v14.84,6.01
  Highspeed2 0.076: v14.84,6.01 14.96,5.89 14.96,4.25 14.84,4.13 v14.84,2.32
  LowSpeed 0.076: v14.84,6.01 15.1,6.01 R7.1 | J6.19 9.25,1 9.25,1.5 10.07,2.32 v14.84,2.32
I2C_SDA_A  (via drill 0.1)
  Highspeed1 0.076: 6.5,3.4 J3.18 6.5,3.36 6.18,3.04 v6.18,2.71 | U1.L6 v10.8,8.08
  Highspeed2 0.076: v6.18,2.71 6.18,3.01 6.88,3.72 6.88,4.23 7.76,5.11 8.28,5.11 8.68,5.51 8.93,5.51 9.15,5.74 9.15,6.43 9.38,6.66 9.38,8 9.74,8.36 10.53,8.36 v10.8,8.08
  LowSpeed 0.076: v6.18,2.71 6.2,2.74 6.2,3.78 5.86,4.12 R10.1
I2C_SDA_B  (via drill 0.1)
  Highspeed2 0.076: U1.M8 11.8,7.2 10.9,6.3 10.9,4.95 9.8,3.85 9.8,3.6 v9.2,2.99
  LowSpeed 0.076: 9.5,3.4 J6.18 9.5,3.29 v9.2,2.99 | R4.1 10.75,7.1 10.87,7.23 11.63,7.23 11.8,7.4 U1.M8
  other vias: 11.8,7.6
JTAGEN  (via drill 0.1)
  LowSpeed 0.076: R5.2 U1.G7
  other vias: 11.3,10.1
LH_DATA0  (via drill 0.1)
  Highspeed2 0.076: U12.C1 6.03,6.02 6.38,6.02 7.2,6.85 7.2,7.5 8.59,8.89 8.79,8.89 8.8,8.9 9.3,8.9 9.51,9.11 9.51,9.29 10.3,10.08 U1.G5
  other vias: 5.9,5.9 10.3,10.1
LH_DATA1  (via drill 0.1)
  Highspeed1 0.076: U1.H3 9.3,9.73 v9.25,9.78
  Highspeed2 0.076: v9.25,9.78 9.25,9.7 8.87,9.32 8.27,9.32 6.84,7.89 6.43,7.89 5.92,7.38 5.92,7.32 5.79,7.2 5.7,7.2 5.7,7.19 5.1,7.19 4.52,6.62 3.2,6.62 2.88,6.3 2.88,5.82 U11.C1
  other vias: 2.9,5.8
LH_DATA2  (via drill 0.1)
  LowSpeed 0.076: U1.B11 13.8,13.1 U13.C1
  other vias: 13.3,12.6
LH_ENV0  (via drill 0.1)
  Highspeed1 0.076: v5.8,5.61 6.11,5.61 U12.C2
  Highspeed2 0.076: U1.F5 10.3,10.5 10.54,10.27 10.54,9.95 10.21,9.62 9.85,9.26 9.85,9.09 9.46,8.7 8.8,8.7 7.5,7.4 7.5,6.85 6.51,5.86 6.24,5.86 5.98,5.6 v5.81,5.6 v5.8,5.61
  other vias: 10.3,10.6
LH_ENV1  (via drill 0.1)
  Highspeed1 0.076: U1.J2 v8.7,9.1
  Highspeed2 0.076: U11.C2 3.79,6.19 4.5,6.19 5.26,6.95 5.79,6.95 6.47,7.64 6.94,7.64 8.4,9.1 v8.7,9.1
  other vias: 3.4,5.8
LH_ENV2  (via drill 0.1)
  Highspeed1 0.076: U1.B13 14.35,12.65 v14.35,12.8
  LowSpeed 0.076: U13.C2 14.6,13.05 v14.35,12.8
MIDFILT
  Highspeed1 0.076: R25.1 8.57,13.95 L10.2
  Highspeed1 0.5: 8.52,15.88 8.55,15.91 8.55,16.2 | 8.55,16.2 L9.1 8.55,15.69 8.14,15.28 8.14,14.92 8.32,14.74 L10.2 | 8.32,15.97 8.55,16.2
N$1
  LowSpeed 0.076: U10.1 12.25,6 12.12,5.88 U9.3
N$2
  LowSpeed 0.076: R26.1 U10.4
N$3  (via drill 0.1)
  Highspeed1 0.076: v13.9,5.77 13.9,5.33 13.88,5.31 13.88,4.6 14.4,4.09 14.65,4.09 14.89,3.84 14.89,2.8 | 14.89,2.8 14.89,2.75 | 14.89,2.75 14.89,2.7 | J3.35 11.6,1.4 11.78,1.58 12.3,1.58 12.57,1.85 14.04,1.85 14.89,2.71 14.89,2.75 | 14.89,2.75 14.89,2.8
  LowSpeed 0.076: v13.9,5.77 13.71,5.96 R27.2
N$4  (via drill 0.1)
  LowSpeed 0.2: L3.2 8.53,8.67 8.1,9.1 C17.1 C13.1 | C13.1 8.14,9.71 | 8.62,9.9 C20.1 | 8.62,9.9 8.62,9.78 U1.H2 | C13.1 8.47,9.75 8.62,9.9
  other vias: 8.8,9.6
N$5  (via drill 0.1)
  Highspeed1 0.076: v8.02,1.78 8.2,1.95 10,1.95 10.3,2.25 12.02,2.25 12.33,2.56 12.78,2.56 13.23,3.01 13.3,3.01 13.37,3.09 v13.37,3.89
  Highspeed2 0.076: v4.76,1.43 7.68,1.43 v8.02,1.78
  LowSpeed 0.076: R26.2 13.58,4.2 13.37,3.99 v13.37,3.89 | v4.76,1.43 4.4,1.07 J6.35
N$6
  LowSpeed 0.076: R27.1 13.55,5.36 13.07,5.84 12.79,5.84 12.65,5.99 U10.2
N$7
  Highspeed1 0.076: 3.7,5 3.7,4.9 | D4.C 3.7,4.8 3.7,5 | 3.7,5 3.7,5.05 3.66,5.09 3.66,6.56 U11.A3
N$8
  Highspeed1 0.076: D4.A 2.45,4.6 3.15,5.3 3.15,6.55 U11.A2
N$9
  Highspeed1 0.2: U11.B1 2.85,6.3 R30.2
N$10
  cutout GND1: 0,16.7 arc-90 2,18.7 arc-90 4,16.7 arc-90 2,14.7 arc-90
N$11
  cutout LowSpeed: 0,16.7 arc-90 2,18.7 arc-90 4,16.7 arc-90 2,14.7 arc-90
N$12
  Highspeed1 0.2: U11.A1 2.7,6.8 C53.1
N$13  (via drill 0.1, 0.3)
  Highspeed1 0.076: L9.2 11.15,16 v11.25,16 | v9.44,15.24 9.44,14.82 R25.2
  Highspeed2 0.076: v11.25,16 10.75,15.5 9.7,15.5 v9.44,15.24
  LowSpeed 0.3: 11.33,16 v11.25,16 L8.1 11.58,16.36 C51.1
N$14  (via drill 0.1)
  Highspeed1 0.076: D5.C 12.8,5.05 v13.25,5.05 | U12.A3 v6.93,6.9 v6.94,6.91
  Highspeed2 0.076: v13.25,5.05 13.25,4.98 12.93,4.65 12.93,2.86 12.13,2.06 10.06,2.06 8.88,0.88 4.62,0.88 4.35,1.15 4.35,4.71 6.54,6.9 v6.93,6.9 v6.94,6.91
N$15  (via drill 0.1)
  Highspeed1 0.076: 14.65,4.81 14.57,4.81 14.46,4.7 v14.18,4.7 | 14.65,4.81 14.77,4.7 | v6.5,7.36 6.5,7 U12.A2 | D5.A 14.65,4.85 14.65,4.81
  Highspeed2 0.076: v14.18,4.7 13.19,4.7 13.08,4.59 13.08,4.09 13.08,4.05 13.08,2.8 | v6.5,7.36 6.5,7.07 4.2,4.77 4.2,1.09 4.56,0.72 8.94,0.72 10.13,1.91 12.19,1.91 13.08,2.79 13.08,2.8 | 13.08,2.8
N$16
  Highspeed1 0.2: U12.B1 R31.2
N$17
  cutout VCC: 0,16.7 arc-90 2,18.7 arc-90 4,16.7 arc-90 2,14.7 arc-90
N$18
  cutout GND2: 0,16.7 arc-90 2,18.7 arc-90 4,16.7 arc-90 2,14.7 arc-90
N$19
  cutout Highspeed1: 0,16.7 arc-90 2,18.7 arc-90 4,16.7 arc-90 2,14.7 arc-90
N$20
  cutout GND1: 12,16.7 arc-90 14,18.7 arc-90 16,16.7 arc-90 14,14.7 arc-90
N$21
  cutout LowSpeed: 12,16.7 arc-90 14,18.7 arc-90 16,16.7 arc-90 14,14.7 arc-90
N$22
  cutout VCC: 12,16.7 arc-90 14,18.7 arc-90 16,16.7 arc-90 14,14.7 arc-90
N$23
  cutout GND2: 12,16.7 arc-90 14,18.7 arc-90 16,16.7 arc-90 14,14.7 arc-90
N$24
  cutout Highspeed1: 12,16.7 arc-90 14,18.7 arc-90 16,16.7 arc-90 14,14.7 arc-90
N$25
  cutout GND1: 2.65,19.7 2.65,18.5 13.25,18.5 13.25,19.7
N$26  (via drill 0.1)
  Highspeed1 0.076: 12.15,14.5 D6.C 11.95,14 12.46,14 13.05,14 13.75,13.3 13.75,13.01 14.05,12.71 14.05,12.55 | 14.05,12.52 14.05,12.55 | 14.05,12.55 14.05,12.51 14.2,12.36 14.97,12.36 v15.03,12.31
  LowSpeed 0.076: U13.A3 15.1,12.24 v15.03,12.31
N$27  (via drill 0.1)
  Highspeed1 0.076: D6.A 9.95,14.4 10.6,13.75 11.54,13.75 11.55,13.74 12.35,13.74 12.46,13.85 12.52,13.85 12.98,13.85 13.56,13.27 13.56,12.5 13.7,12.36 13.9,12.36 14.06,12.2 14.4,12.2 v14.5,12.1
  LowSpeed 0.076: U13.A2 v14.5,12.1
N$28
  Highspeed1 0.15: 1,11.08 C43.2 C43.2 arc45 0.8,10.62 arc66 1.14,10.1 1.25,10.05 U4.13
N$29
  LowSpeed 0.076: U13.B1 13.5,12 R32.2
N$30  (via drill 0.1)
  Highspeed1 0.076: 1.83,12.12 U4.9 v1.8,12.08
  LowSpeed 0.076: C48.1 R20.2 1.5,12.8 1.5,12.38 v1.8,12.08
N$31  (via drill 0.1)
  Highspeed1 0.15: v1.16,10.6 1.71,10.6 U4.12
  LowSpeed 0.15: C44.2 1.05,10.71 v1.16,10.6
N$32
  LowSpeed 0.15: C44.1 R21.2
N$33  (via drill 0.1)
  Highspeed1 0.076: U4.8 v2.41,12.9
  LowSpeed 0.076: R24.1 R23.2 2.43,13.23 C50.1 2.43,12.88 v2.41,12.9
N$34  (via drill 0.1)
  Highspeed1 0.2: U4.10 2.26,11.55 v2.31,11.6
  LowSpeed 0.076: C38.1 v2.31,11.6
  LowSpeed 0.2: C38.1 C35.1 2.97,12.67 L6.2 3.58,13.05 3.8,13.05 3.89,13.13 C45.1
N$35  (via drill 0.2)
  Highspeed1 0.2: U4.14 v2.23,9.56
  LowSpeed 0.2: C40.1 2.37,9.57 C47.1 2.32,8.95 L7.2 | C40.1 C37.1 | C40.1 2.27,9.6 v2.23,9.56
N$36
  Highspeed1 0.2: U12.A1 5.3,6.9 C54.1
N$37
  LowSpeed 0.2: U13.A1 13.93,11.93 13.93,11.62 13.8,11.5 C55.1
N$38  (via drill 0.2)
  VCC 0.3: v7.86,12.83 8.74,13.71 8.74,14.65 9.12,15.03 v9.12,15.04
  LowSpeed 0.1: 9.9,14.82 9.9,14.78 9.88,14.76
  LowSpeed 0.2: C32.1 9.94,14.44 U5.3 10.07,14.65 9.9,14.82 9.9,14.98 10.07,15.16 U5.4 10.07,15.21 | U3.7 5.83,16.52
  LowSpeed 0.3: U3.8 5.83,16.52 U3.6 5.31,15.82 5.2,15.71 5.2,15.08 5.73,14.55 5.73,13.98 U6.B1 U6.B2 U6.B3 U6.A3 7.89,12.8 v7.86,12.83 | 9.95,13.6 9.94,13.61 C32.1 | v9.12,15.04 9.18,14.98 | C27.1 8.78,15.38 v9.12,15.04 | v9.12,15.04 9.2,14.96 C25.1 9.88,14.76 9.96,14.68
N$39  (via drill 0.1)
  Highspeed1 0.076: 0.6,6.02 U14.B1 0.18,6.42 0.18,6.74 0.23,6.79 v0.23,7.43
  LowSpeed 0.076: C62.1 0.23,8.17 v0.23,7.43
N$40
  LowSpeed 0.076: U15.B1 1.01,7.06 1.28,7.33 1.28,7.55 1.1,7.73 C63.1
N$41
  LowSpeed 0.076: R35.1 C67.1 1.03,4.67 1.21,4.86 1.21,6.44 U15.C1
N$67
  LowSpeed 0.076: U8.9 4.75,4.4 4.55,4.2 C34.2
N$92  (via drill 0.1)
  Highspeed1 0.076: D2.2 13.85,13.95 v13.75,13.85
  LowSpeed 0.076: R6.2 v13.75,13.85
N$93  (via drill 0.1)
  Highspeed1 0.076: D1.2 15,13.95 v14.9,14.05
  LowSpeed 0.076: v14.9,14.05 14.9,14 R3.2
NCONFIG  (via drill 0.1)
  Highspeed1 0.076: U1.E8 12.15,10.75 v12.3,10.75
  LowSpeed 0.076: 12.36,10.81 v12.3,10.75 12.33,10.75 R16.2
NP_OSC_EN  (via drill 0.1)
  Highspeed1 0.076: U1.P8 11.86,6.54 11.86,5.82 10.52,4.48 v10.52,4.23
  LowSpeed 0.076: U9.1 v10.52,4.23
NRST  (via drill 0.1)
  Highspeed1 0.076: v15.5,5.8 15.54,5.84 15.54,6.36 U1.P15 | U14.C1 0.36,5.36 0.33,5.36 0.27,5.29 0.27,3.73 0.37,3.62 v0.37,3.4 | v6.3,1.7 6,1.7 5.6,1.3 J3.15
  Highspeed2 0.076: v15.5,5.8 15.21,5.51 15.21,2.34 14.94,2.07 v14.56,2.07
  LowSpeed 0.076: R35.2 0.37,3.97 v0.37,3.4 0.37,2.71 1.27,1.82 2.06,1.82 2.37,2.12 6.3,2.12 | v14.56,2.07 10.95,2.07 10.4,1.52 J6.15 10.4,0.55 10.15,0.3 9.19,0.3 8.94,0.55 8.94,1.81 8.62,2.12 6.3,2.12 | v6.3,1.7 6.3,2.12
NSTATUS  (via drill 0.1)
  LowSpeed 0.076: 10.9,11.6 U1.D6
  other vias: 10.8,11.6
OSC_PDOWN_N_A  (via drill 0.1)
  Highspeed1 0.076: v4.7,2.9 J3.12 | v8.29,5.77 8.38,5.86 8.4,5.86 8.54,6 8.54,6.19 8.71,6.36 9.06,6.36 U1.P3
  Highspeed2 0.076: v4.7,2.9 4.7,4.16 5.52,4.98 6.83,4.98 7.44,5.59 8.11,5.59 v8.29,5.77
OSC_PDOWN_N_B  (via drill 0.1)
  Highspeed1 0.076: U1.L10 v12.8,8.08
  Highspeed2 0.076: v12.8,8.08 12.8,7.35 13.02,7.13 13.02,6.52 12.4,5.9 12.4,4.87 11.87,4.33 11.87,3.84 11.11,3.08 v11.11,2.94
  LowSpeed 0.076: J6.12 11.3,3.13 v11.11,2.94
PSB_CLK_A  (via drill 0.1)
  Highspeed1 0.076: v11.22,1.51 11,1.29 J3.33
  Highspeed2 0.076: U1.K4 9.98,8.78 13,8.78 13.22,8.55 13.22,8.09 13.8,7.51 13.8,6.24 14.47,5.57 14.47,4.62 13.43,3.58 13.43,1.38 13.16,1.1 11.63,1.1 v11.22,1.51
  other vias: 9.8,8.6
PSB_CLK_B  (via drill 0.1)
  Highspeed2 0.076: U1.L4 10.07,7.83 10.07,6.7 10.1,6.67 10.1,5.6 6.75,2.25 5.63,2.25 v5.29,1.91
  LowSpeed 0.076: J6.33 5,1.62 v5.29,1.91
  other vias: 9.8,8.1
PSB_DATA_0_A  (via drill 0.1)
  Highspeed1 0.076: v14.56,5.79 14.3,6.05 U1.R13 | J3.31 10.4,1.17 v10.68,1.45
  Highspeed2 0.076: v14.56,5.79 14.72,5.64 14.72,4.42 14.05,3.75 14.05,2.05 13.7,1.7 13.7,1.15 13.3,0.75 11.38,0.75 v10.68,1.45
PSB_DATA_0_B  (via drill 0.1)
  Highspeed1 0.076: U1.L7 v11.3,8.07
  Highspeed2 0.076: v11.3,8.07 11.3,7.41 10.7,6.81 10.7,5.15 9.58,4.03 9.58,3.83 8.03,2.28 7.25,2.28 6.96,1.99 5.99,1.99 v5.84,1.84
  LowSpeed 0.076: v5.84,1.84 5.6,1.6 J6.31
PSB_DATA_1_A
  Highspeed1 0.076: 10.15,3.59 10.15,4.62 11.54,6 11.54,6.36 U1.P7 | 10.15,3.59 10.15,3.52 | J3.30 10.1,3.54 10.15,3.59
PSB_DATA_1_B  (via drill 0.1)
  Highspeed2 0.076: U1.M4 9.8,6.7 9.9,6.6 9.9,5.76 6.62,2.48 5.92,2.48 v5.75,2.65
  LowSpeed 0.076: J6.30 5.9,2.8 v5.75,2.65
  other vias: 9.8,7.6
PSB_DATA_2_A
  Highspeed1 0.076: U1.P6 10.8,6.2 9.5,4.9 J3.28
PSB_DATA_2_B  (via drill 0.1)
  Highspeed1 0.076: U1.P4 v9.64,6.44
  Highspeed2 0.076: v6.5,2.75 7.12,3.37 7.12,4.07 7.92,4.87 8.47,4.87 8.89,5.29 9.08,5.29 9.37,5.57 9.37,6.02 9.64,6.3 v9.64,6.44
  LowSpeed 0.076: J6.28 v6.5,2.75
PSB_DATA_3_A
  Highspeed1 0.076: U1.P12 13.8,6.2 13.68,6.08 13.68,4.43 14.21,3.91 14.5,3.91 14.59,3.8 14.59,2.79 13.9,2.1 12.53,2.1 12.25,1.82 10.72,1.82 10.4,1.5 9.4,1.5 9.2,1.3 J3.27
PSB_DATA_3_B  (via drill 0.1)
  Highspeed1 0.076: U1.L8 v11.85,8.05 v11.86,8.05
  Highspeed2 0.076: v11.86,8.05 12.05,7.86 12.05,7 11.27,6.22 11.27,5.33 11.1,5.16 11.1,4.51 9.37,2.78 9.19,2.78 8.86,2.45 8.5,2.45 8.1,2.04 7.64,2.04 v7.4,1.8
  LowSpeed 0.076: J6.27 6.8,1.2 v7.4,1.8
PSB_DATA_4_A
  Highspeed1 0.076: U1.R11 13.46,5.93 13.46,4.31 14,3.78 14,2.56 13.79,2.35 12.45,2.35 12.16,2.06 10.49,2.06 10.15,1.72 9.07,1.72 8.6,1.25 J3.25
PSB_DATA_4_B  (via drill 0.1)
  Highspeed1 0.076: U1.L9 v12.3,8.08
  Highspeed2 0.076: v12.3,8.08 12.55,7.83 12.55,6.55 11.91,5.91 11.91,5.21 11.6,4.9 11.6,4.13 10.04,2.58 9.28,2.58 v8.3,1.6
  LowSpeed 0.076: J6.25 7.4,1.4 7.56,1.56 8.26,1.56 v8.3,1.6
PSB_DATA_5_A
  Highspeed1 0.076: U1.R7 11.13,6.1 9.82,4.79 9.82,3.11 9.46,2.75 8.75,2.75 8.35,3.15 8.35,3.38 J3.24
PSB_DATA_5_B  (via drill 0.1)
  Highspeed2 0.076: U1.M5 10.3,5.47 8.97,4.14 8.91,4.14 8.79,4.02 8.79,3.96 7.92,3.09 v7.92,2.96
  LowSpeed 0.076: J6.24 7.7,3.18 v7.92,2.96
  other vias: 10.3,7.6
PSB_DATA_6_A
  Highspeed1 0.076: J3.22 7.7,3.6 8,3.9 8.68,3.9 8.75,3.97 8.75,4.41 9.13,4.79 9.13,4.99 10.24,6.1 U1.R5 10.2,6.1
PSB_DATA_6_B  (via drill 0.1)
  Highspeed1 0.076: v10.59,7.85 11.05,7.85 U1.M7
  Highspeed2 0.076: v10.59,7.85 10.59,7.06 10.51,6.98 10.51,5.3 9.21,4 9.21,3.84 9.09,3.71 9.08,3.71 8.18,2.82 v8.18,2.79
  LowSpeed 0.076: J6.22 8.3,2.91 v8.18,2.79
PSB_SYNC_A
  Highspeed1 0.076: U1.P9 12.59,6.3 12.59,5.85 11.86,5.11 11.8,5.11 11.7,5.01 11.7,4.06 11.83,3.93 12.05,3.93 12.21,3.77 12.21,3.13 12.1,3.01 11.99,3.01 11.46,2.49 10.01,2.49 9.8,2.28 8.18,2.28 7.62,1.72 7.62,1.71 7.4,1.5 J3.21
PSB_SYNC_B  (via drill 0.1)
  Highspeed1 0.076: v13.23,7.72 13.3,7.65 U1.M11
  Highspeed2 0.076: v13.23,7.72 13.3,7.65 13.3,5.75 12.68,5.12 12.68,4.67 12.2,4.2 12.2,3.3 11.6,2.7 10.51,2.7 10.19,2.38 9.43,2.38 v8.7,1.65
  LowSpeed 0.076: J6.21 8.6,0.85 8.6,1.55 v8.7,1.65
REC_NRST_A  (via drill 0.1)
  Highspeed1 0.076: U1.R3 9.21,6.1 v8.94,5.83 | J3.16 5.9,3.31 v5.54,2.95
  Highspeed2 0.076: v8.94,5.83 8.68,5.83 8.17,5.32 7.53,5.32 6.67,4.46 6.67,3.98 5.64,2.95 v5.54,2.95
REC_NRST_B  (via drill 0.1)
  Highspeed2 0.076: U1.M9 12.32,7.58 12.32,6.8 11.54,6.02 11.54,5.25 11.3,5.01 11.3,4.3 10.07,3.07 v10.07,2.94
  LowSpeed 0.076: J6.16 10.1,2.97 v10.07,2.94
  other vias: 12.3,7.6
SER_DIN0  (via drill 0.1)
  Highspeed1 0.076: U4.19 v3.4,7.44 | U1.B8 v11.8,12.46
  Highspeed2 0.076: v3.4,7.44 4.25,8.29 4.79,8.29 6.46,9.96 6.46,10.55 7.81,11.9 8.16,11.9 8.65,12.39 8.9,12.39 8.91,12.4 10.2,12.4 10.21,12.39 10.39,12.39 10.4,12.4 11.74,12.4 v11.8,12.46
SER_DIN1  (via drill 0.1)
  Highspeed1 0.076: v4,7.4 3.91,7.49 U4.20 | U1.C8 11.8,11.96 v11.74,11.9
  Highspeed2 0.076: v4,7.4 4,7.54 4.43,7.97 4.77,7.97 6.7,9.9 6.7,10.45 7.88,11.64 8.33,11.64 8.89,12.2 11.44,12.2 v11.74,11.9
SER_DIN2  (via drill 0.1)
  Highspeed1 0.076: U4.21 v4.4,7.43 | U1.B4 9.71,12.6 v9.09,11.98
  Highspeed2 0.076: v4.4,7.43 4.71,7.75 4.85,7.75 6.92,9.83 6.92,10.18 7.55,10.8 7.91,10.8 v9.09,11.98
SER_DIN3  (via drill 0.1)
  Highspeed1 0.076: U4.22 v4.9,7.4 | U1.B6 v10.18,11.98
  Highspeed2 0.076: v10.18,11.98 10.02,11.82 9.63,11.82 9.07,11.26 8.7,11.26 4.9,7.46 v4.9,7.4
SER_DIN4  (via drill 0.1)
  Highspeed1 0.076: U1.B7 11.26,12.6 v10.64,11.98 | U4.23 5.41,7.48 v5.35,7.42
  Highspeed2 0.076: v10.64,11.98 10.53,11.87 10.53,11.48 10.35,11.3 9.45,11.3 9.15,11 9.15,10.96 7.98,9.8 7.65,9.8 7.42,9.57 7.41,9.57 7.29,9.44 5.35,7.5 v5.35,7.42
SER_DIN5  (via drill 0.1)
  Highspeed1 0.076: U4.24 5.91,7.62 v5.7,7.41
  Highspeed2 0.076: v5.7,7.41 5.7,7.49 6.59,8.38 7.09,8.38 7.09,8.39 7.1,8.39 7.22,8.51 7.22,8.52 7.39,8.69 7.39,8.86 8.08,9.55 8.25,9.55 9.36,10.65 9.58,10.65 9.8,10.88 10.97,10.88 11.29,11.2 12.39,11.2 U1.D10
  other vias: 12.8,11.6
SER_DIN6
  Highspeed1 0.076: U4.26 6.71,9.05 7.42,9.76 7.42,9.92 7.9,10.4 7.95,10.4 8.65,11.1 U1.E2
SER_DIN7
  Highspeed1 0.076: U4.27 6.71,9.55 7.15,9.99 7.15,10.36 7.87,11.09 8.29,11.09 U1.E1
SER_DIN8
  Highspeed1 0.076: U1.D2 8.7,11.6 8.63,11.53 7.75,11.53 6.77,10.55 U4.29
SER_DIN9
  Highspeed1 0.076: U1.C2 8.5,11.8 7.7,11.8 6.95,11.05 U4.30
SER_DIN10
  Highspeed1 0.076: U1.C1 8.25,12.15 8.25,12.2 7.4,12.2 6.74,11.55 U4.31
SER_DIN11
  Highspeed1 0.076: U4.32 6.85,12.05 7.37,12.57 8.27,12.57 U1.B1
SER_GPIO0  (via drill 0.1)
  Highspeed1 0.076: U4.15 2.05,9.05 2.19,8.91 2.19,8.37 2.1,8.28 2.1,7.53 v2.23,7.4 | v11.12,13.28 U1.A7
  Highspeed2 0.076: v11.12,13.28 10.97,13.43 7.53,13.43 6.85,12.75 6.85,12.65 6.65,12.45 6.55,12.45 5.3,11.2 5.3,9.8 4.6,9.1 3.3,9.1 2.23,8.03 v2.23,7.4
SER_GPIO1  (via drill 0.1)
  Highspeed1 0.076: U4.16 | U4.16 1.59,8.55 | v12.51,13.24 12.37,13.1 U1.A9 | U4.16 1.09,8.55 TP10.TP | U4.16 v1.94,8.55
  Highspeed2 0.076: v12.51,13.24 12.31,13.24 12.23,13.17 11.81,13.17 11.33,13.64 6.8,13.64 5.46,12.3 5.46,12.26 5.1,11.9 5.1,9.9 4.5,9.3 3,9.3 2.25,8.55 v1.94,8.55
SER_GPIO2  (via drill 0.1)
  Highspeed1 0.076: U4.17 2.41,7.59 v2.6,7.4 2.6,7.35 R36.1 | U1.B14 14.8,12.74 v14.85,12.79
  Highspeed2 0.076: v2.6,7.4 2.6,8 3.5,8.9 4.7,8.9 5.5,9.7 5.5,10.96 7.64,13.1 10.92,13.1 10.98,13.04 11.61,13.04 11.66,12.99 12.84,12.99 12.95,13.1 14.54,13.1 v14.85,12.79
SER_GPIO3  (via drill 0.1)
  Highspeed1 0.076: U4.18 2.91,7.5 v3,7.41 | U1.B12 v13.78,12.6
  Highspeed2 0.076: v3,7.41 3,8 3.7,8.7 4.8,8.7 5.7,9.6 5.7,10.7 7.4,12.4 8.06,12.4 8.48,12.82 9.06,12.82 9.25,12.62 9.63,12.62 9.82,12.82 11.3,12.82 11.32,12.8 11.95,12.8 12.43,12.33 13.5,12.33 v13.78,12.6
SER_HSYNC
  Highspeed1 0.076: U1.A2 8.55,13.35 7.55,13.35 6.65,12.45 5.91,12.45 U4.1
SER_PCLK  (via drill 0.1)
  Highspeed1 0.076: U4.3 4.91,13.01 v5.15,13.25 | v12.85,13.6 13.3,13.15 U1.A11
  Highspeed2 0.076: v5.15,13.25 5.75,13.85 12.6,13.85 v12.85,13.6
SER_SCL  (via drill 0.1)
  Highspeed1 0.076: v5.15,12.26 4.55,12.26 4.41,12.4 U4.4 4.41,13.15 v4.85,13.59 v4.86,13.59 | U1.A13 v13.9,13.5
  Highspeed2 0.076: v13.9,13.5 13.4,13.5 12.84,14.06 5.33,14.06 v4.86,13.59
  LowSpeed 0.076: 5.11,12.2 R11.1 5.21,12.2 v5.15,12.26
SER_SDA  (via drill 0.1)
  Highspeed1 0.076: U4.5 3.91,13.09 | U4.5 v3.91,12.69 | U4.5 3.91,13.11 v4.4,13.6 | U1.A14 14.8,13.25 v14.55,13.5
  Highspeed2 0.076: v14.55,13.5 13.96,14.09 13.57,14.09 13.37,14.29 5.08,14.29 v4.4,13.6
  LowSpeed 0.076: v3.91,12.69 4.19,12.69 R15.1
SER_VSYNC
  Highspeed1 0.076: U4.2 5.41,13.01 6,13.6 8.8,13.6 U1.A3
SIGOUT
  Highspeed1 0.15: C43.1 1.04,11.78 arc-45 1.7,13.47 2.09,13.87 arc-45 3.79,14.57 D3.C | D3.C 5.67,14.58 J2.P$1
  Highspeed1 0.203: D3.C
  Highspeed1 0.5: J2.P$1 6.24,14.2 L10.1
STATUS_A  (via drill 0.1)
  Highspeed1 0.076: v15.33,14.81 15.33,14.37 D1.1 | U1.C15 15.3,12.25 v15.34,12.29
  Highspeed2 0.076: v15.33,14.81 15.49,14.65 15.49,12.44 v15.34,12.29
STATUS_B
  Highspeed1 0.076: U1.B15 15.3,12.65 15.06,12.89 15.06,13.52 14.54,14.04 14.54,14.1 14.29,14.35 D2.1
TCK  (via drill 0.1)
  Highspeed1 0.076: v7.1,8.9 7.3,9.1 U1.J1
  LowSpeed 0.076: 4.11,17.83 TP3.TP 4.19,14.68 R9.1 4.27,14.33 4.75,13.85 4.9,13.85 5.61,13.15 5.61,12.4 6.3,11.7 6.3,10.37 7.1,9.57 v7.1,8.9
  LowSpeed 0.1: 4.08,19.75 4.08,19.28 4.07,19.28 4.07,18.04 TP3.TP
  LowSpeed 0.2: J1.1 15.98,45.67 17.25,44.4 17.25,33.85 4.08,20.68 4.08,19.75
TDI  (via drill 0.1)
  Highspeed1 0.076: U1.H5 v10.29,9.41
  LowSpeed 0.076: 9.98,9.41 9.97,9.41 | 9.98,9.41 v10.29,9.41 | 8.04,17.92 TP4.TP 8.38,17.54 R13.2 8.38,16.96 8.27,16.84 8.27,14.84 8.44,14.67 8.44,12.12 8.79,11.77 9.16,11.77 9.28,11.64 9.28,10.11 9.98,9.41
  LowSpeed 0.1: TP4.TP 8,18.1 7.78,18.32 7.77,18.32 7.37,18.72 7.37,19.47 7.4,19.6
  LowSpeed 0.2: J1.9 7.38,47.42 18.73,47.42 20.05,46.1 20.05,34.75 7.4,22.1 7.4,19.6 | TP4.TP arc-90 7.77,18.15
TDO  (via drill 0.1)
  Highspeed1 0.076: U1.H4 9.29,10.12 9.29,11.79 v9.45,11.96
  Highspeed1 0.1: TP5.TP 6.73,18.37 7.08,18.72 7.08,19.6
  Highspeed1 0.2: J1.3 13.28,45.67 14.5,44.45 14.5,41.55 11.93,38.97 10.22,38.97 7,35.75 7,20.9 7.08,20.82 7.08,19.6
  Highspeed2 0.076: v8.57,15.1 8.57,16.08 TP5.TP
  LowSpeed 0.076: v9.45,11.96 9.24,12.17 9.24,13.11 9.12,13.23 8.84,13.23 8.68,13.39 8.68,14.99 v8.57,15.1
  other vias: 6.73,17.92
TMS  (via drill 0.1, 0.2)
  Highspeed1 0.076: U1.G1 8.05,10.1 v7.99,10.16
  Highspeed1 0.1: TP2.TP 5.46,19.56 5.5,19.6
  Highspeed1 0.2: v4.75,35.5 5.5,34.75 5.5,19.6
  LowSpeed 0.076: v7.99,10.16 7.94,10.11 6.99,10.11 6.53,10.57 6.53,11.85 5.8,12.58 5.8,13.31 5.37,13.74 5.37,14.18 4.79,14.76 4.79,15.44 4.45,15.78 4.45,16.65 4.78,16.98 R8.2 4.81,17.27 TP2.TP
  LowSpeed 0.2: v4.75,35.5 4.75,37.6 9.35,42.2 9.35,44.32 J1.5
  other vias: 5.46,17.92
VCCA  (via drill 0.1, 0.2)
  Highspeed1 0.076: U1.N2 v8.82,7.12
  Highspeed1 0.2: v14.23,7.56 14.23,6.67 U1.P13 v14.3,6.63 | U1.D14 14.3,11.6 | C5.1 14.3,11.19 14.3,11.6 | v12.4,12.05 13.85,12.05 14.3,11.6 | U1.B3 v9.54,12.84
  Highspeed2 0.2: v14.23,7.56 13.9,7.89 13.9,10.79 C5.1
  VCC 0.2: v14.23,7.56 14.23,7.43 13.2,6.4 10.3,6.4 9.58,7.12 v8.82,7.12 | v9.54,12.84 10.11,12.28 11.5,12.28 11.6,12.18 11.98,12.18 12.11,12.05 v12.4,12.05
  LowSpeed 0.076: L1.2 14.27,7.6 v14.23,7.56 | C3.1 v8.83,7.11 v8.82,7.12
  LowSpeed 0.2: C7.1 14.27,6.67 v14.3,6.63 | C1.1 v9.54,12.84
  other vias: 14.27,11.16
VCCIO  (via drill 0.1, 0.2)
  Highspeed1 0.2: U1.B10 U1.B9 | U1.F14 U1.G14 14.49,10.1 v14.39,10 | U1.L14 14.8,8.16 14.49,8.47 14.49,8.81 v14.39,8.91
  Highspeed2 0.2: v14.39,10 14.68,10.29 14.68,11.43 14.06,12.04 14.06,12.74 13.91,12.88 13.07,12.88 U1.B10
  VCC 0.2: U1.B10 12.5,12.91 10.61,12.91 U1.B5
  LowSpeed 0.2: C10.1 13.92,8.91 v14.39,8.91 | v14.39,8.91 14.78,8.91 15.18,9.31 C22.1 | U1.B10 C15.1 | C19.1 U1.B5 | v14.39,8.91 v14.39,10 14.34,10.05 L5.2
  other vias: 10.3,12.6 12.8,12.6
VCCIO2  (via drill 0.1)
  Highspeed1 0.2: U1.P11 U1.P10 v12.8,6.87 v12.81,6.88 | U1.L2 v8.95,7.95 9.15,7.75 9.15,7.14 9.32,6.97 9.93,6.97 U1.P5 10.69,6.99 v11.22,6.99
  LowSpeed 0.2: C9.1 8.7,7.95 v8.95,7.95 | v11.22,6.99 11.22,6.54 C21.1 11.61,6.88 v12.81,6.88 12.94,6.75 C18.1 C14.1 14.2,6.18 L4.2
VCCIOA  (via drill 0.1)
  Highspeed1 0.2: U1.F2 8.8,10.65 v8.65,10.8
  LowSpeed 0.2: C12.1 | L2.2 6.96,10.9 C23.1 7.76,10.85 C12.1 | C12.1 8.37,10.8 v8.65,10.8 8.87,10.8 C16.1
VCOAX  (via drill 0.3)
  Highspeed2 0.4: J5.1 3.4,28.35 v9.6,22.15
  VCC 0.4: v7.5,16.55 8.02,16.03 L8.2
  LowSpeed 0.2: TP1.TP 10.35,18.11 10.35,19.55 9.6,20.3 9.6,20.45 | 9.65,16.01 9.67,16.03
  LowSpeed 0.3: 9.6,22.2 v9.6,22.15 | 9.67,16.03 L8.2 9.65,16.07 9.65,16.3 9.84,16.49 9.84,16.89 C61.1 10,17.38 TP1.TP 10.46,17.92 | U3.1 7.65,16.6 | 7.65,16.6 U3.2 7.57,16.32 | 7.65,16.6 7.6,16.55 v7.5,16.55
  LowSpeed 0.4: 9.6,20.45 v9.6,22.15
  other vias: 9.61,16.03

## Text on the board
tPlace: JTAG | GND | GND | +5.0V | GND | GND | EXT POW / No coax! | 1
bPlace: hs-neuropix / Rev. 1.3 JPN '20 | G LINK | G LINK